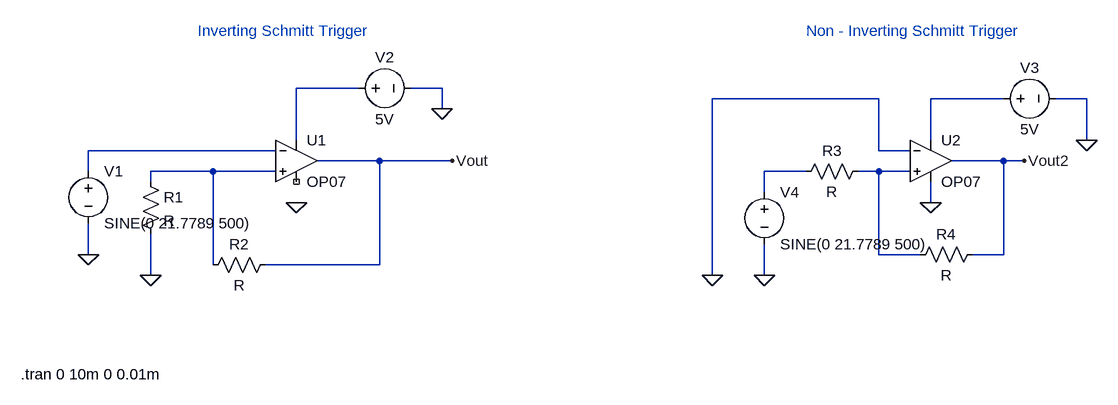
[diagram p0: schematic zero-crossing-test.asc]
zero-crossing-test.asc, the LTspice schematic file:
Version 4
SHEET 1 948 952
WIRE -192 496 -288 496
WIRE -64 496 -112 496
WIRE 608 512 352 512
WIRE 800 512 688 512
WIRE 928 512 880 512
WIRE -64 528 -64 496
WIRE -288 576 -288 496
WIRE 688 576 688 512
WIRE 928 576 928 512
WIRE -320 592 -608 592
WIRE 608 592 608 512
WIRE 656 592 608 592
WIRE -160 608 -256 608
WIRE -48 608 -160 608
WIRE 800 608 720 608
WIRE 832 608 800 608
WIRE -608 624 -608 592
WIRE -416 624 -512 624
WIRE -320 624 -416 624
WIRE 496 624 432 624
WIRE 608 624 576 624
WIRE 656 624 608 624
WIRE -512 640 -512 624
WIRE 432 656 432 624
WIRE 688 672 688 640
WIRE -608 752 -608 704
WIRE 608 752 608 624
WIRE 672 752 608 752
WIRE 800 752 800 608
WIRE 800 752 752 752
WIRE -416 768 -416 624
WIRE -160 768 -160 608
WIRE -160 768 -336 768
WIRE -512 784 -512 720
WIRE 352 784 352 512
WIRE 432 784 432 736
FLAG -288 672 0
FLAG 688 672 0
FLAG -512 784 0
FLAG -48 608 Vout
FLAG -608 752 0
FLAG -64 528 0
FLAG 928 576 0
FLAG 832 608 Vout2
FLAG 432 784 0
FLAG 352 784 0
SYMBOL OpAmps\\OP07 -288 544 R0
SYMATTR InstName U1
SYMBOL OpAmps\\OP07 688 544 R0
SYMATTR InstName U2
SYMBOL res -528 624 R0
SYMATTR InstName R1
SYMBOL res -320 752 R90
WINDOW 0 0 56 VBottom 2
WINDOW 3 32 56 VTop 2
SYMATTR InstName R2
SYMBOL voltage -608 608 R0
WINDOW 123 0 0 Left 0
WINDOW 39 0 0 Left 0
SYMATTR InstName V1
SYMATTR Value SINE(0 21.7789 500)
SYMBOL voltage -208 496 R270
WINDOW 0 32 56 VTop 2
WINDOW 3 -32 56 VBottom 2
WINDOW 123 0 0 Left 0
WINDOW 39 0 0 Left 0
SYMATTR InstName V2
SYMATTR Value 5V
SYMBOL voltage 784 512 R270
WINDOW 0 32 56 VTop 2
WINDOW 3 -32 56 VBottom 2
WINDOW 123 0 0 Left 0
WINDOW 39 0 0 Left 0
SYMATTR InstName V3
SYMATTR Value 5V
SYMBOL voltage 432 640 R0
WINDOW 123 0 0 Left 0
WINDOW 39 0 0 Left 0
SYMATTR InstName V4
SYMATTR Value SINE(0 21.7789 500)
SYMBOL res 592 608 R90
WINDOW 0 0 56 VBottom 2
WINDOW 3 32 56 VTop 2
SYMATTR InstName R3
SYMBOL res 768 736 R90
WINDOW 0 0 56 VBottom 2
WINDOW 3 32 56 VTop 2
SYMATTR InstName R4
TEXT -440 408 Left 2 ;Inverting Schmitt Trigger
TEXT 496 408 Left 2 ;Non - Inverting Schmitt Trigger
TEXT -712 936 Left 2 !.tran 0 10m 0 0.01m

The netlist it stands for:
* zero-crossing-test.asc
XU1 N004 N003 N001 NC_01 Vout LT1001  ; OP07, pins In+ In- V+ V- OUT
XU2 N006 0 N002 0 Vout2 LT1001  ; OP07, pins In+ In- V+ V- OUT
R1 N004 0 R
R2 Vout N004 R
V1 N003 0 SINE(0 21.7789 500)
V2 N001 0 5V
V3 N002 0 5V
V4 N005 0 SINE(0 21.7789 500)
R3 N006 N005 R
R4 Vout2 N006 R
* Inverting Schmitt Trigger
* Non - Inverting Schmitt Trigger
.tran 0 10m 0 0.01m
.lib LTC.lib
.backanno
.end